# EAGLE design Arduino Diff COMM (EAGLE 6.5.0)
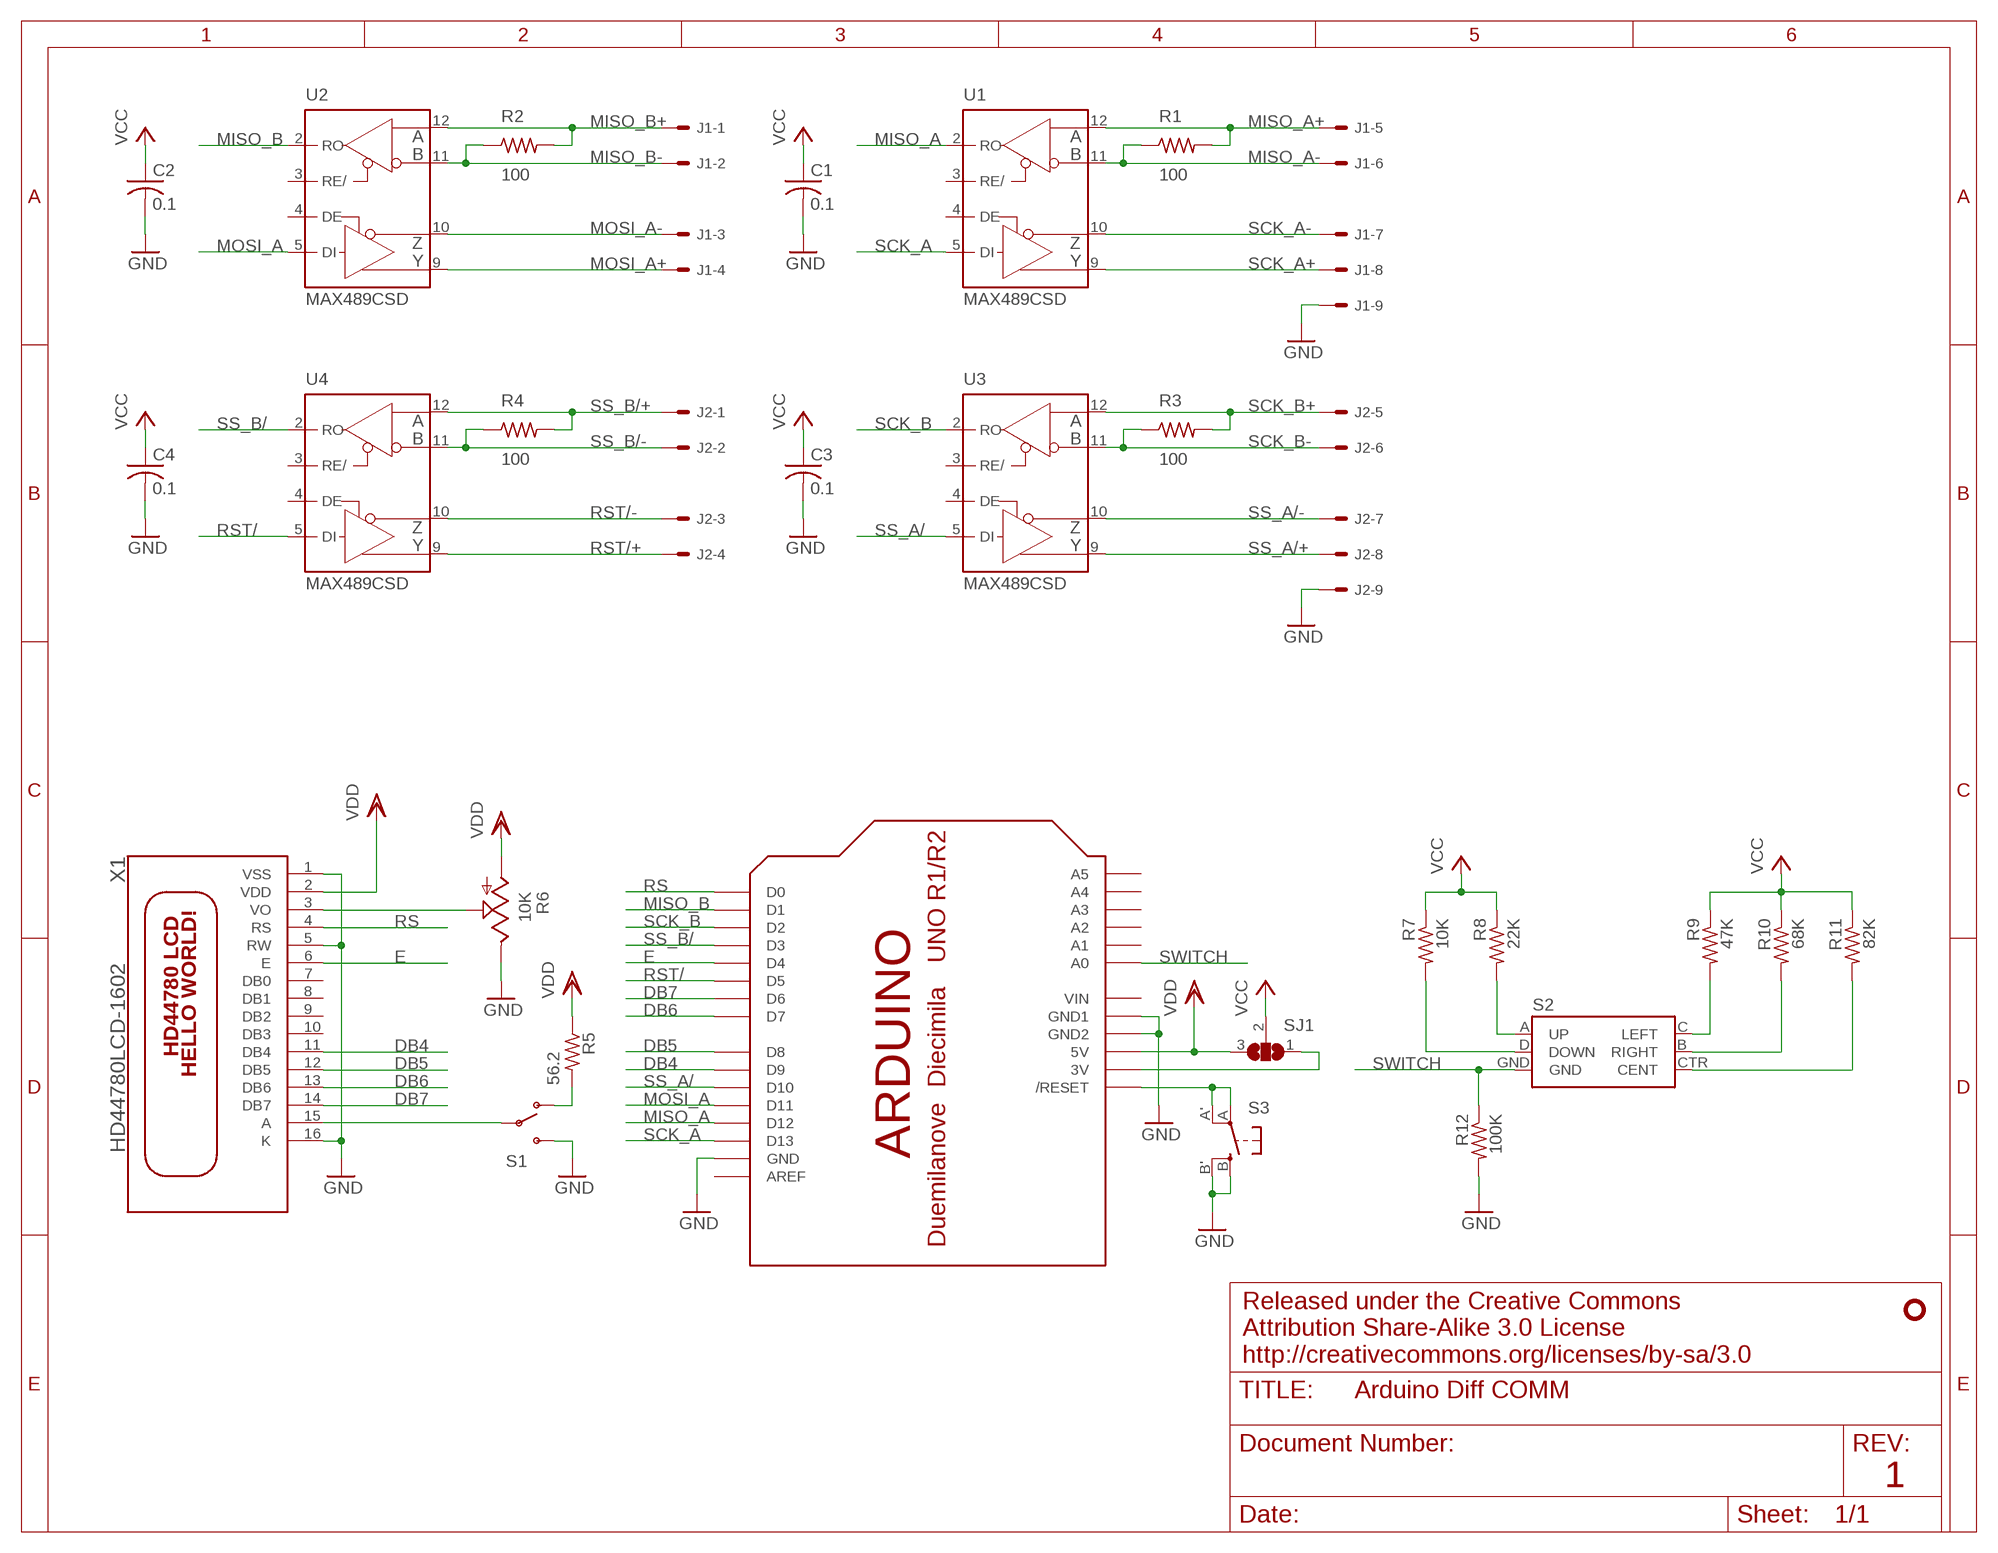
[diagram p0: schematic, sheet 1]

## Parts
C1  0.1  C-USC0603K  [C0603K]
C2  0.1  C-USC0603K  [C0603K]
C3  0.1  C-USC0603K  [C0603K]
C4  0.1  C-USC0603K  [C0603K]
J1  22-05-7098-09  [7395-09]
J2  22-05-7098-09  [7395-09]
R1  100  R-US_R1206  [R1206]
R2  100  R-US_R1206  [R1206]
R3  100  R-US_R1206  [R1206]
R4  100  R-US_R1206  [R1206]
R5  56.2  R-US_R0805  [R0805]
R6  10K  TRIM_US-3223G  [3223G]
R7  10K  R-US_R0805  [R0805]
R8  22K  R-US_R0805  [R0805]
R9  47K  R-US_R0805  [R0805]
R10  68K  R-US_R0805  [R0805]
R11  82K  R-US_R0805  [R0805]
R12  100K  R-US_R0805  [R0805]
S1  SWITCH_SPDT  [KPS-1290]
S2  JOYSTICK_MINI  [JOYSTICK_MINI]
S3  SPST_TACT-EVQQ2  [EVQ-Q2]
SJ1  SJ2W  [SJ_2]
U1  MAX489CSD  [SO14]
U2  MAX489CSD  [SO14]
U3  MAX489CSD  [SO14]
U4  MAX489CSD  [SO14]
U$1  ARDUINO-NOHOLE  [ARDUINO-NOHOLE]
U$2  PENGUIN_LOGOCOPPER  [PENGUIN_COPPER]
X1  HD44780LCD-1602  [LCD1602]

## Nets
DB4: U$1.D9 X1.11(DB4)
DB5: U$1.D8 X1.12(DB5)
DB6: U$1.D7 X1.13(DB6)
DB7: U$1.D6 X1.14(DB7)
E: U$1.D4 X1.6(E)
GND: C1.2 C2.2 C3.2 C4.2 J1.9 J2.9 R6.3(E) R12.2 S1.S S3.B'(S1) S3.B(S) U$1.GND U$1.GND1 U$1.GND2 X1.1(VSS) X1.5(RW) X1.16(K)
MISO_A: U1.2(RO) U$1.D12
MISO_A+: J1.5 R1.2 U1.12(A)
MISO_A-: J1.6 R1.1 U1.11(B)
MISO_B: U2.2(RO) U$1.D1
MISO_B+: J1.1 R2.2 U2.12(A)
MISO_B-: J1.2 R2.1 U2.11(B)
MOSI_A: U2.5(DI) U$1.D11
MOSI_A+: J1.4 U2.9(Y)
MOSI_A-: J1.3 U2.10(Z)
N$1: R5.2 S1.O
N$3: R8.2 S2.A(UP)
N$4: S1.P X1.15(A)
N$5: R9.2 S2.C(LEFT)
N$6: R11.2 S2.CTR(CENT)
N$7: R10.2 S2.B(RIGHT)
N$8: R7.2 S2.D(DOWN)
N$9: R6.2(S) X1.3(VO)
N$10: SJ1.1 U$1.3V
N$13: S3.A'(P1) S3.A(P) U$1.RESET(/RESET)
RS: U$1.D0 X1.4(RS)
RST/: U4.5(DI) U$1.D5
RST/+: J2.4 U4.9(Y)
RST/-: J2.3 U4.10(Z)
SCK_A: U1.5(DI) U$1.D13
SCK_A+: J1.8 U1.9(Y)
SCK_A-: J1.7 U1.10(Z)
SCK_B: U3.2(RO) U$1.D2
SCK_B+: J2.5 R3.2 U3.12(A)
SCK_B-: J2.6 R3.1 U3.11(B)
SS_A/: U3.5(DI) U$1.D10
SS_A/+: J2.8 U3.9(Y)
SS_A/-: J2.7 U3.10(Z)
SS_B/: U4.2(RO) U$1.D3
SS_B/+: J2.1 R4.2 U4.12(A)
SS_B/-: J2.2 R4.1 U4.11(B)
SWITCH: R12.1 S2.GND U$1.A0
VCC: C1.1 C2.1 C3.1 C4.1 R7.1 R8.1 R9.1 R10.1 R11.1 SJ1.2
VDD: R5.1 R6.1(A) SJ1.3 U$1.5V X1.2(VDD)
Unconnected: U1.1(NC) U1.3(RE/) U1.4(DE) U1.8(NC) U1.13(NC) U2.1(NC) U2.3(RE/) U2.4(DE) U2.8(NC) U2.13(NC) U3.1(NC) U3.3(RE/) U3.4(DE) U3.8(NC) U3.13(NC) U4.1(NC) U4.3(RE/) U4.4(DE) U4.8(NC) U4.13(NC) U$1.A1 U$1.A2 U$1.A3 U$1.A4 U$1.A5 U$1.AREF X1.7(DB0) X1.8(DB1) X1.9(DB2) X1.10(DB3)

## Notes on the sheet
- Released under the Creative Commons
  Attribution Share-Alike 3.0 License
  http://creativecommons.org/licenses/by-sa/3.0
- 1

## Power pins joined to a net without a drawn wire
GND: U1.6(GND) U1.7(GND) U2.6(GND) U2.7(GND) U3.6(GND) U3.7(GND) U4.6(GND) U4.7(GND)
VCC: U1.14(VCC) U2.14(VCC) U3.14(VCC) U4.14(VCC)
VIN: U$1.VIN

## Library data of the parts
C1-C4 = rcl:C-US: CAPACITOR, American symbol
J1 J2 = con-molex:22-?-09: CONNECTOR wire to board 2.54 mm (.1 inch) pitch header; OC_FARNELL: unknown; OC_NEWARK: unknown
R1-R5 R7-R12 = rcl:R-US_: RESISTOR, American symbol
R6 = pot:TRIM_US-: POTENTIOMETER
S1 = SparkFun-Electromechanical:SWITCH_SPDT: Side-actuated SPDT slide switch, as used on the Arduino Pro
S2 = SparkFun-Electromechanical:JOYSTICK_MINI: Small 5-way tactile joystick, COM-10063 4UCON SF303GJ26
S3 = adafruit:SPST_TACT: SMT 6mm switch, EVQQ2 series http://www.ladyada.net/library/eagle
SJ1 = jumper:SJ2W: SMD solder JUMPER
U1-U4 = maxim:MAX489CSD: RS485 TRANSEIVER; MF: MAXIM; MPN: MAX489CSD; OC_FARNELL: 9724559; OC_NEWARK: 34C3923
U$1 = adafruit:ARDUINO: Arduino Diecimila/Duemilanove Make a shield with ease, this package has all the named pins as well as the two mounting drill holes and an outline of the USB and DC power connector. The outline is on the DIMENSION layer, so if your board house uses it they will cut the outline to match. http://www.ladyada.net/library/pcb/eaglelibrary.html
U$2 = custom:PENGUIN_LOGO
X1 = adafruit:HD44780LCD: HD44780 LCD Standard character type LCDs, available in sizes from 8x1 to 40x4!

## Board
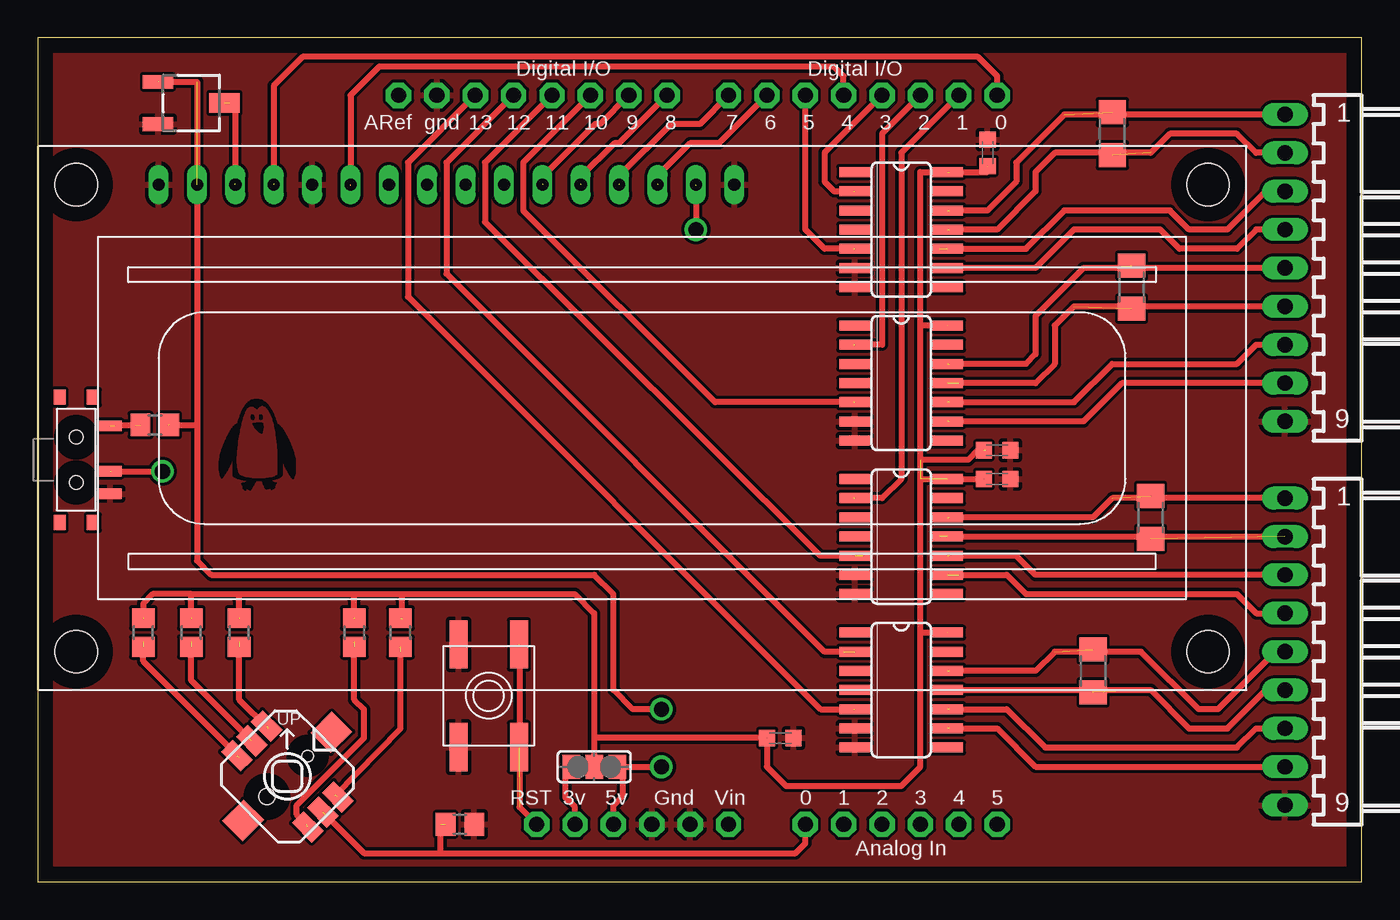
[diagram p1: board, top side]
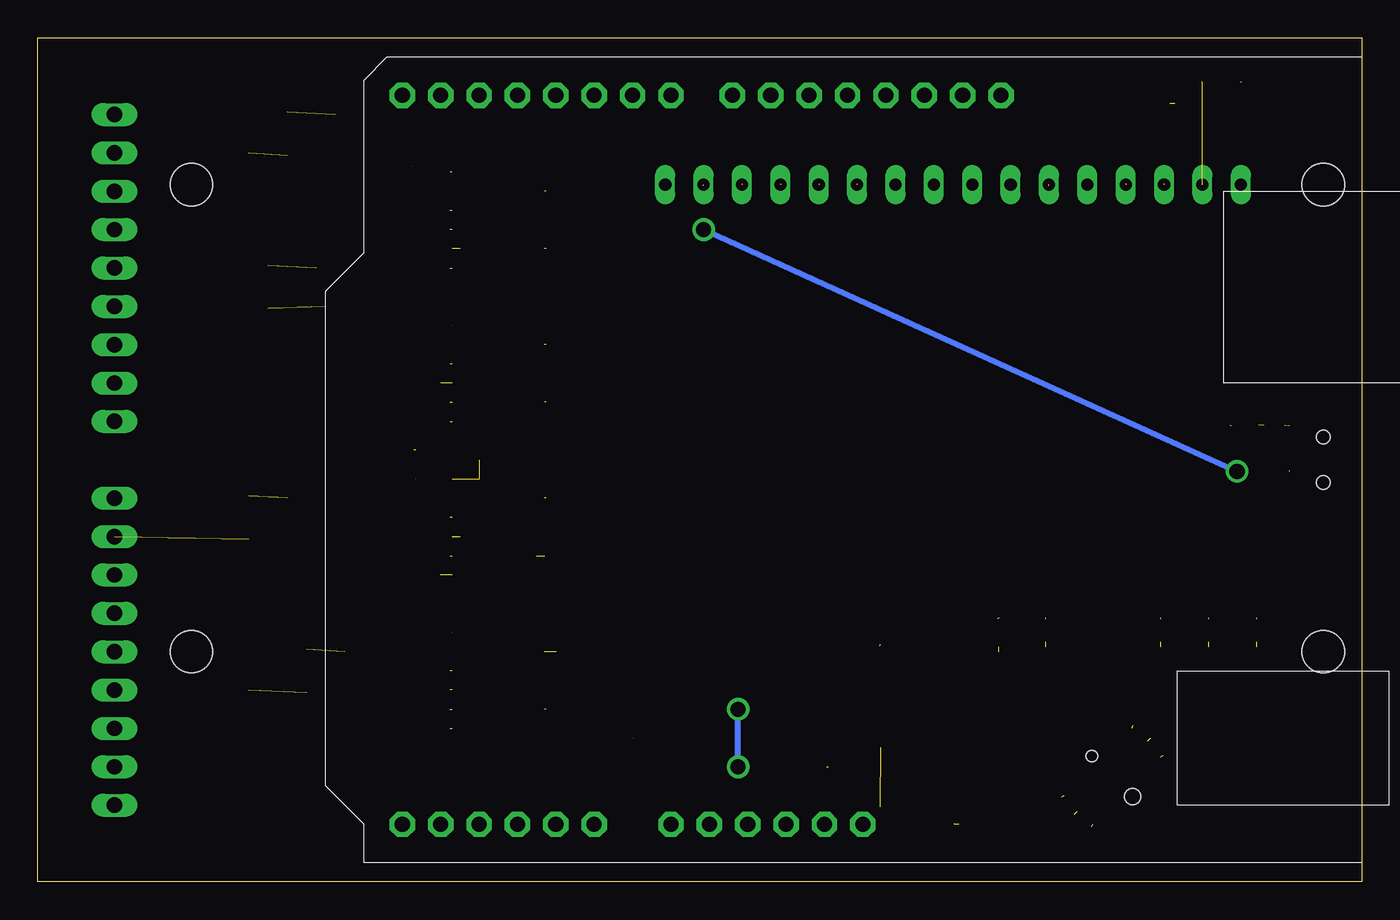
[diagram p2: board, bottom side, seen from below]

Size 87.63 x 55.88 mm. Coordinates in mm from the lower left corner, seen from the top.
Outline: 0,0 87.63,0 87.63,55.88 0,55.88 0,0
Copper layers (1*16): Top 0.035mm / dielectric 1.5mm / Bottom 0.035mm
Design rules "default": minimum track width 10mil, minimum drill 24mil, track to track 8mil, track to pad 8mil, pad to pad 8mil, via to via 8mil, smd to smd 8mil, copper to edge 40mil, drill to drill 8mil, minimum pad ring 10mil, minimum via ring 8mil, stop-mask expansion 4mil, vias tented up to drill 0mil, thermal gap 10mil

### Footprints (pad centres in the part's own frame; a part is rotated, then mirrored left to right if it is on the bottom)
C0603K = smd 1.05 x 1.08: 1 -0.875,0; 2 0.875,0
7395-09 = drill 1.016 long: 1 10.16,0; 2 7.62,0; 3 5.08,0; 4 2.54,0; 5 0,0; 6 -2.54,0; 7 -5.08,0; 8 -7.62,0; 9 -10.16,0
R1206 = smd 1.6 x 1.803: 1 -1.422,0; 2 1.422,0
R0805 = smd 1.3 x 1.5: 1 -0.95,0; 2 0.95,0
3223G = smd 2 x 0.9: 1 -2.2,1.4; 3 -2.2,-1.4 | smd 2 x 1.3: 2 2.2,0
KPS-1290 = smd 0.7 x 1.5: O -2.25,2.25; P 0.75,2.25; S 2.25,2.25 | smd 1 x 0.8: P$1 -4.15,1.1; P$2 -4.15,-1.1; P$3 4.15,-1.1; P$4 4.15,1.1 | hole 0.9: -1.5,0; 1.5,0
JOYSTICK_MINI = smd 1.85 x 1.1: A -3.325,1.4; B 3.325,1.4; C -3.325,-1.4; CTR -3.325,0; D 3.325,-1.4; GND 3.325,0 | smd 1.9 x 2: NC 0,4.13; NC@0 0,-4.13 | hole 0.75: 0,1.9 | hole 1.05: 0,-1.9
EVQ-Q2 = smd 3.2 x 1.2: A -3.4,-2; A' 3.4,-2; B -3.4,2; B' 3.4,2
SJ_2 = smd 1.168 x 1.6: 1 -1.524,0; 2 0,0; 3 1.524,0
SO14 = smd 0.66 x 2.032: 1 -3.81,-3.073; 2 -2.54,-3.073; 3 -1.27,-3.073; 4 0,-3.073; 5 1.27,-3.073; 6 2.54,-3.073; 7 3.81,-3.073; 8 3.81,3.073; 9 2.54,3.073; 10 1.27,3.073; 11 0,3.073; 12 -1.27,3.073; 13 -2.54,3.073; 14 -3.81,3.073
ARDUINO-NOHOLE = drill 1 pad 1.676 octagon: 3V 35.56,2.54; 5V 38.1,2.54; A0 50.8,2.54; A1 53.34,2.54; A2 55.88,2.54; A3 58.42,2.54; A4 60.96,2.54; A5 63.5,2.54; AREF 23.876,50.8; D0 63.5,50.8; D1 60.96,50.8; D2 58.42,50.8; D3 55.88,50.8; D4 53.34,50.8; D5 50.8,50.8; D6 48.26,50.8; D7 45.72,50.8; D8 41.656,50.8; D9 39.116,50.8; D10 36.576,50.8; D11 34.036,50.8; D12 31.496,50.8; D13 28.956,50.8; GND 26.416,50.8; GND1 43.18,2.54; GND2 40.64,2.54; RESET 33.02,2.54; VIN 45.72,2.54
LCD1602 = drill 0.8 long: 1 8,33.46; 2 10.54,33.46; 3 13.08,33.46; 4 15.62,33.46; 5 18.16,33.46; 6 20.7,33.46; 7 23.24,33.46; 8 25.78,33.46; 9 28.32,33.46; 10 30.86,33.46; 11 33.4,33.46; 12 35.94,33.46; 13 38.48,33.46; 14 41.02,33.46; 15 43.56,33.46; 16 46.1,33.46 | hole 2.8: 2.54,2.54; 2.54,33.46; 77.46,33.46; 77.46,2.54

### Placement (x,y rotation side)
C1  49.15,9.53 0 top
C2  63.5,26.67 0 top
C3  63.5,28.57 0 top
C4  62.87,48.26 90 top
J1  82.55,15.24 90 top
J2  82.55,40.64 90 top
R1  69.85,13.97 90 top
R2  73.66,24.13 90 top
R3  72.39,39.37 90 top
R4  71.12,49.53 90 top
R5  7.75,30.25 180 top
R6  10.16,51.56 0 top
R7  20.95,16.51 270 top
R8  13.34,16.51 270 top
R9  6.99,16.51 270 top
R10  24,16.51 270 top
R11  10.16,16.51 270 top
R12  27.94,3.81 0 top
S1  2.54,27.94 270 top
S2  16.51,6.99 315 top
S3  29.84,12.32 90 top
SJ1  36.83,7.62 0 top
U1  57.15,12.7 270 top
U2  57.15,22.86 270 top
U3  57.15,33.02 270 top
U4  57.15,43.18 270 top
U$1  0,1.27 0 top
U$2  14.53,28.96 0 top
X1  0,12.7 0 top

### Tracks (layer width: path | path; a pad name or v marks a point on that pad's centre or on a via)
DB4  (1 unrouted)
  Top 0.406: U$1.D9 37.21,50.16 36.89,50.16 33.4,46.67 33.4,46.23
DB5  (1 unrouted)
  Top 0.406: 35.94,46.23 35.94,46.67 38.16,48.9 38.48,48.9 U$1.D8
DB6  (1 unrouted)
  Top 0.406: U$1.D7 43.81,50.16 41.91,50.16 38.48,46.74 38.48,46.23
DB7  (1 unrouted)
  Top 0.406: U$1.D6 45.09,48.9 43.18,48.9 41.02,46.74 41.02,46.23
E  (1 unrouted)
  Top 0.406: 20.7,46.1 20.7,52.07 22.61,53.98 52.7,53.98 53.34,53.34 U$1.D4
GND
  pour Top: 0,0 0,55.88 87.63,55.88 87.63,0
  pour Top: 0,55.88 0,0 87.63,0 87.63,55.88
MISO_A  (1 unrouted)
  Top 0.406: 53.34,15.24 52.07,15.24 27.05,40.26 27.05,47.62 U$1.D12
MISO_A+  (2 unrouted)
  Top 0.406: J1.5 81.92,15.24 78.11,11.43 76.83,11.43 73.03,15.24 67.31,15.24 66.04,13.97 60.33,13.97
MISO_A-  (2 unrouted)
  Top 0.406: 60.33,12.7 73.66,12.7 76.2,10.16 78.74,10.16 81.28,12.7 J1.6
MISO_B  (1 unrouted)
  Top 0.406: U$1.D1 57.15,48.26 57.15,26.67 55.88,25.4 53.98,25.4
MISO_B+  (2 unrouted)
  Top 0.406: J1.1 71.12,25.4 69.85,24.13 60.33,24.13
MISO_B-  (2 unrouted)
  Top 0.406: 59.69,22.86 J1.2
MOSI_A  (1 unrouted)
  Top 0.406: 54.61,21.59 51.82,21.59 29.59,43.69 29.59,47.62 U$1.D11
MOSI_A+  (1 unrouted)
  Top 0.406: 60.96,20.32 64.14,20.32 65.41,19.05 79.38,19.05 80.64,17.78 J1.4
MOSI_A-  (1 unrouted)
  Top 0.406: J1.3 66.04,20.32 64.77,21.59 60.33,21.59
N$1  (2 unrouted)
  Top 0.406: 6.48,30.23 5.08,30.23
N$3  (2 unrouted)
  Top 0.406: 15.24,10.16 13.34,12.06 13.34,15.88
N$4  (via drill 1)  (2 unrouted)
  Top 0.406: 4.83,27.18 v8.26,27.18 | 43.56,46.1 v43.56,43.18
  Bottom 0.406: v8.26,27.18 v43.56,43.18
N$5  (2 unrouted)
  Top 0.406: 13.34,8.26 6.99,14.61 6.99,15.88
N$6  (2 unrouted)
  Top 0.406: 13.97,9.53 10.16,13.34 10.16,15.88
N$7  (2 unrouted)
  Top 0.406: 19.68,5.71 24,10.16 24,15.24
N$8  (2 unrouted)
  Top 0.406: 17.78,3.81 17.14,4.45 17.14,5.08 21.59,9.53 21.59,11.43 20.95,12.06 20.95,15.88
N$9  (2 unrouted)
  Top 0.406: 12.7,51.56 13.08,51.56 13.08,46.23
N$10  (1 unrouted)
  Top 0.406: U$1.3V 35.56,4.95 34.92,5.59 34.92,7.62 35.43,7.62
N$13  (2 unrouted)
  Top 0.406: 31.88,15.62 31.88,4.95 U$1.RESET
RS  (1 unrouted)
  Top 0.406: 15.62,46.23 15.62,52.7 17.53,54.61 62.23,54.61 63.5,53.34 U$1.D0
RST/  (1 unrouted)
  Top 0.406: 53.98,41.91 52.07,41.91 50.8,43.18 U$1.D5
RST/+  (1 unrouted)
  Top 0.406: J2.4 80.64,43.18 79.38,41.91 75.56,41.91 74.3,43.18 68.58,43.18 66.04,40.64 60.33,40.64
RST/-  (1 unrouted)
  Top 0.406: J2.3 81.28,45.72 78.74,43.18 76.2,43.18 74.93,44.45 67.94,44.45 65.41,41.91 59.69,41.91
SCK_A  (1 unrouted)
  Top 0.406: 53.98,11.43 51.82,11.43 24.51,38.73 24.51,47.62 U$1.D13
SCK_A+  (1 unrouted)
  Top 0.406: 60.33,10.16 63.5,10.16 66.04,7.62 J1.8
SCK_A-  (1 unrouted)
  Top 0.406: 60.33,11.43 64.14,11.43 66.67,8.89 79.38,8.89 80.64,10.16 J1.7
SCK_B  (1 unrouted)
  Top 0.406: U$1.D2 55.88,49.53 55.88,35.56 53.98,35.56
SCK_B+  (2 unrouted)
  Top 0.406: J2.5 69.22,40.64 66.04,37.47 66.04,34.92 65.41,34.29 60.33,34.29
SCK_B-  (2 unrouted)
  Top 0.406: J2.6 68.58,38.1 67.31,36.83 67.31,34.29 66.04,33.02 60.96,33.02
SS_A/  (1 unrouted)
  Top 0.406: 53.98,31.75 44.83,31.75 32.13,44.45 32.13,47.62 U$1.D10
SS_A/+  (1 unrouted)
  Top 0.406: J2.8 71.75,33.02 69.22,30.48 60.33,30.48
SS_A/-  (1 unrouted)
  Top 0.406: 60.33,31.75 68.58,31.75 71.12,34.29 79.38,34.29 80.64,35.56 J2.7
SS_B/  (1 unrouted)
  Top 0.406: U$1.D3 52.07,48.26 52.07,46.35 52.7,45.72 53.98,45.72
SS_B/+  (2 unrouted)
  Top 0.406: J2.1 67.94,50.8 64.77,47.62 64.77,46.35 62.87,44.45 60.33,44.45
SS_B/-  (2 unrouted)
  Top 0.406: J2.2 80.64,48.26 79.38,49.53 74.93,49.53 73.66,48.26 67.31,48.26 66.04,46.99 66.04,45.72 63.5,43.18 60.33,43.18
SWITCH  (2 unrouted)
  Top 0.406: 19.05,4.45 21.59,1.91 26.67,1.91 | 26.67,1.91 50.16,1.91 50.8,2.54 U$1.A0 | 26.67,1.91 26.67,3.81
VCC  (15 unrouted)
  Top 0.406: 58.42,16.51 58.42,7.62 57.15,6.35 49.53,6.35 48.26,7.62 C1.1 36.83,9.53 | 58.42,16.51 58.42,26.67 | 58.42,26.67 58.42,36.83 | 60.2,36.83 58.42,36.83 | 58.42,36.83 58.42,46.99 60.2,46.99 | 58.42,26.67 C2.1 | 58.42,16.51 60.2,16.51 | 10.16,19.05 7.62,19.05 6.99,18.41 6.99,17.4 | 10.16,19.05 13.34,19.05 | 13.34,19.05 20.95,19.05 | 20.95,19.05 24.13,19.05 | 36.83,9.53 SJ1.2 | 24.13,17.4 24.13,19.05 | 20.95,17.4 20.95,19.05 | 13.34,17.4 13.34,19.05 | 10.16,17.4 10.16,19.05 | 62.74,28.57 62.23,28.57 61.59,27.94 58.42,27.94 | 60.33,46.99 62.87,46.99 C4.1 | 24.13,19.05 35.56,19.05 36.83,17.78 36.83,9.53
VDD  (via drill 1)  (3 unrouted)
  Top 0.406: U$1.5V 38.1,5.08 38.73,5.71 38.73,7.62 SJ1.3 v41.27,7.62 | 8,52.96 10.54,52.96 10.54,30.23 | 10.54,30.23 8.64,30.23 | 10.54,30.23 10.54,21.27 11.49,20.32 36.83,20.32 38.1,19.05 38.1,12.7 39.37,11.43 v41.27,11.43
  Top 0.813: SJ1.3 38.23,7.62
  Bottom 0.406: v41.27,7.62 v41.27,11.43

### Text on the board
tRestrict: SSB/ | RST/ | SCKB | SSA/ | GND | MISOB | CC 3.0 BY-SA / (C) 2014 D. Wassenberg / Arduino SPI over RS-485 Shield v1 | MOSIA | MISOA | SCKA | GND